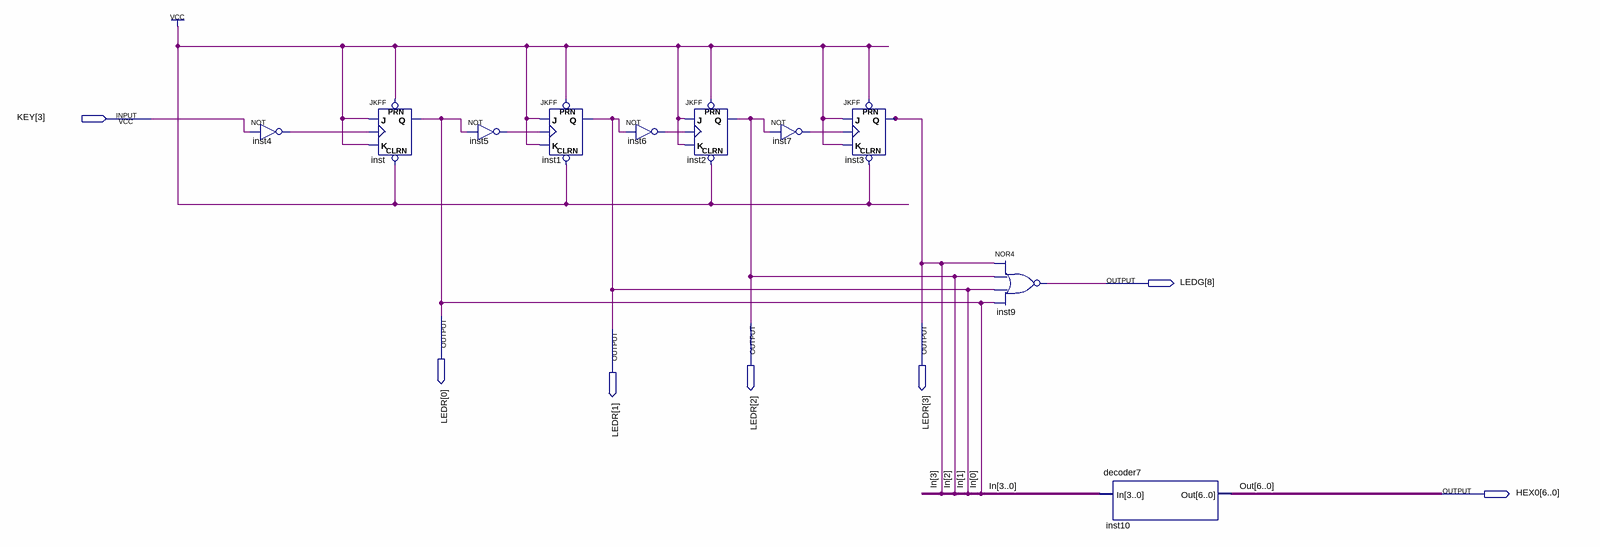
[diagram p0: schematic sheet]
// Quartus schematic Block7.bdf as structural Verilog: 10 symbols, 7 pins
module Block7 (
  input  [3:3] KEY,
  output [8:8] LEDG,
  output [3:0] LEDR,
  output [6:0] HEX0
);

  wire inst4_out, inst5_out, inst6_out, inst7_out;

  not inst4 (inst4_out, KEY[3]);
  JKFF inst (.PRN(1'b1), .CLRN(1'b1), .K(1'b1), .J(1'b1), .CLK(inst4_out), .Q(LEDR[0]));
  not inst5 (inst5_out, LEDR[0]);
  JKFF inst1 (.PRN(1'b1), .CLRN(1'b1), .K(1'b1), .J(1'b1), .CLK(inst5_out), .Q(LEDR[1]));
  not inst6 (inst6_out, LEDR[1]);
  JKFF inst2 (.PRN(1'b1), .CLRN(1'b1), .K(1'b1), .J(1'b1), .CLK(inst6_out), .Q(LEDR[2]));
  not inst7 (inst7_out, LEDR[2]);
  JKFF inst3 (.PRN(1'b1), .CLRN(1'b1), .K(1'b1), .J(1'b1), .CLK(inst7_out), .Q(LEDR[3]));
  nor inst9 (LEDG[8], LEDR[3], LEDR[2], LEDR[1], LEDR[0]);
  decoder7 inst10 (.In(LEDR), .Out(HEX0));

  // Other names for the same wires on the sheet: In[3:0] = LEDR; Out[6:0] = HEX0
endmodule
